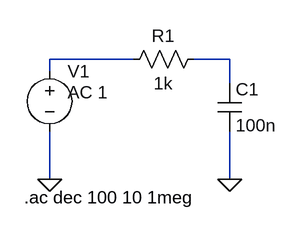
[diagram p0: schematic Draft1.asc]
Draft1.asc, the LTspice schematic file:
Version 4
SHEET 1 880 680
WIRE -304 -96 -416 -96
WIRE -176 -96 -224 -96
WIRE -416 -80 -416 -96
WIRE -176 -64 -176 -96
WIRE -416 64 -416 0
WIRE -176 64 -176 0
FLAG -416 64 0
FLAG -176 64 0
SYMBOL res -208 -112 R90
WINDOW 0 0 56 VBottom 2
WINDOW 3 32 56 VTop 2
SYMATTR InstName R1
SYMATTR Value 1k
SYMBOL cap -192 -64 R0
SYMATTR InstName C1
SYMATTR Value 100n
SYMBOL voltage -416 -96 R0
WINDOW 123 24 44 Left 2
WINDOW 39 0 0 Left 0
SYMATTR InstName V1
SYMATTR Value ""
SYMATTR Value2 AC 1
TEXT -450 88 Left 2 !.ac dec 100 10 1meg

The netlist it stands for:
* Draft1.asc
R1 N002 N001 1k
C1 N002 0 100n
V1 N001 0 AC 1
.ac dec 100 10 1meg
.backanno
.end